# EasyEDA Pro project Class D amp.eprj, board PCB2
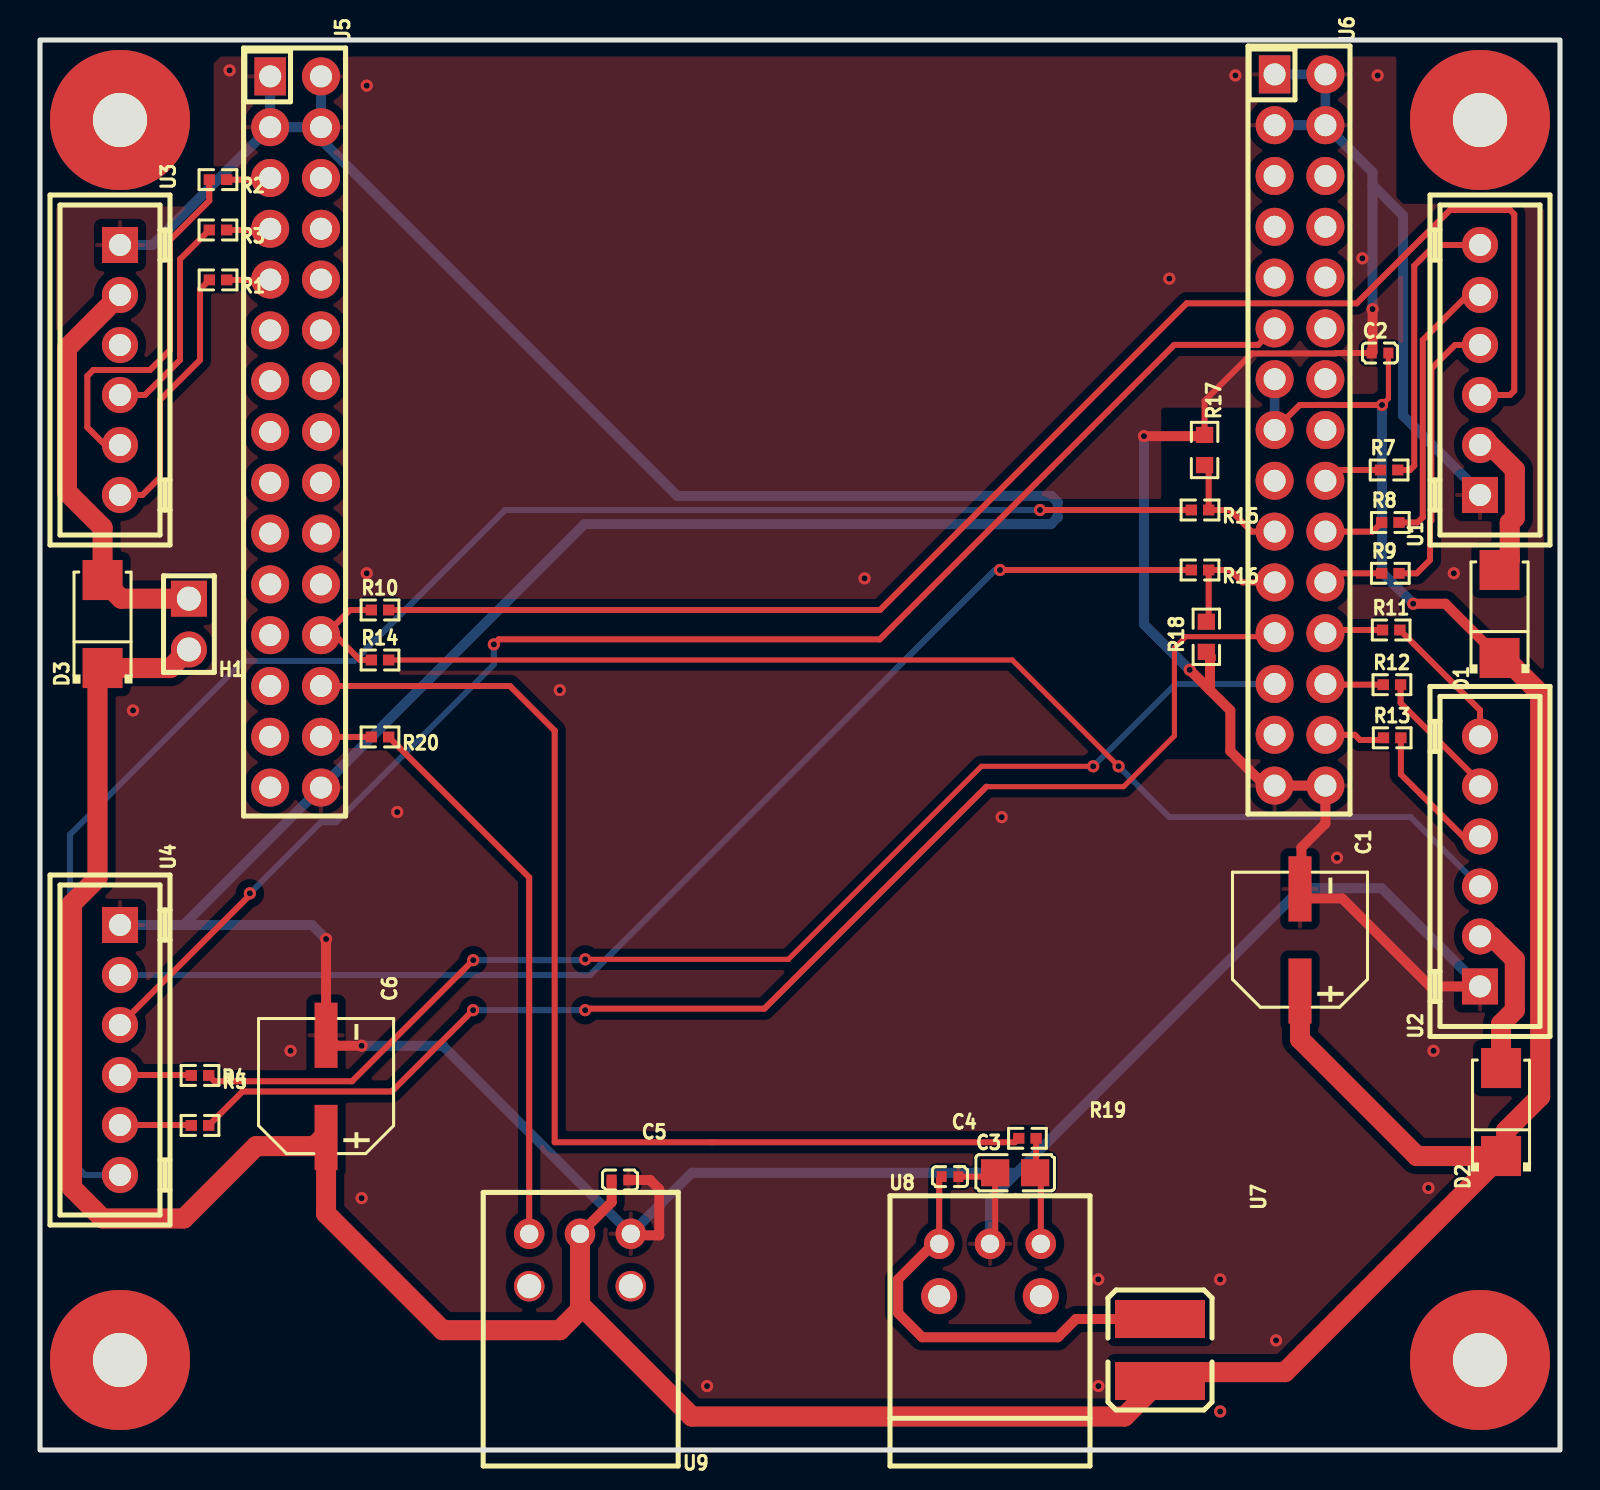
[diagram p8: board, top side]
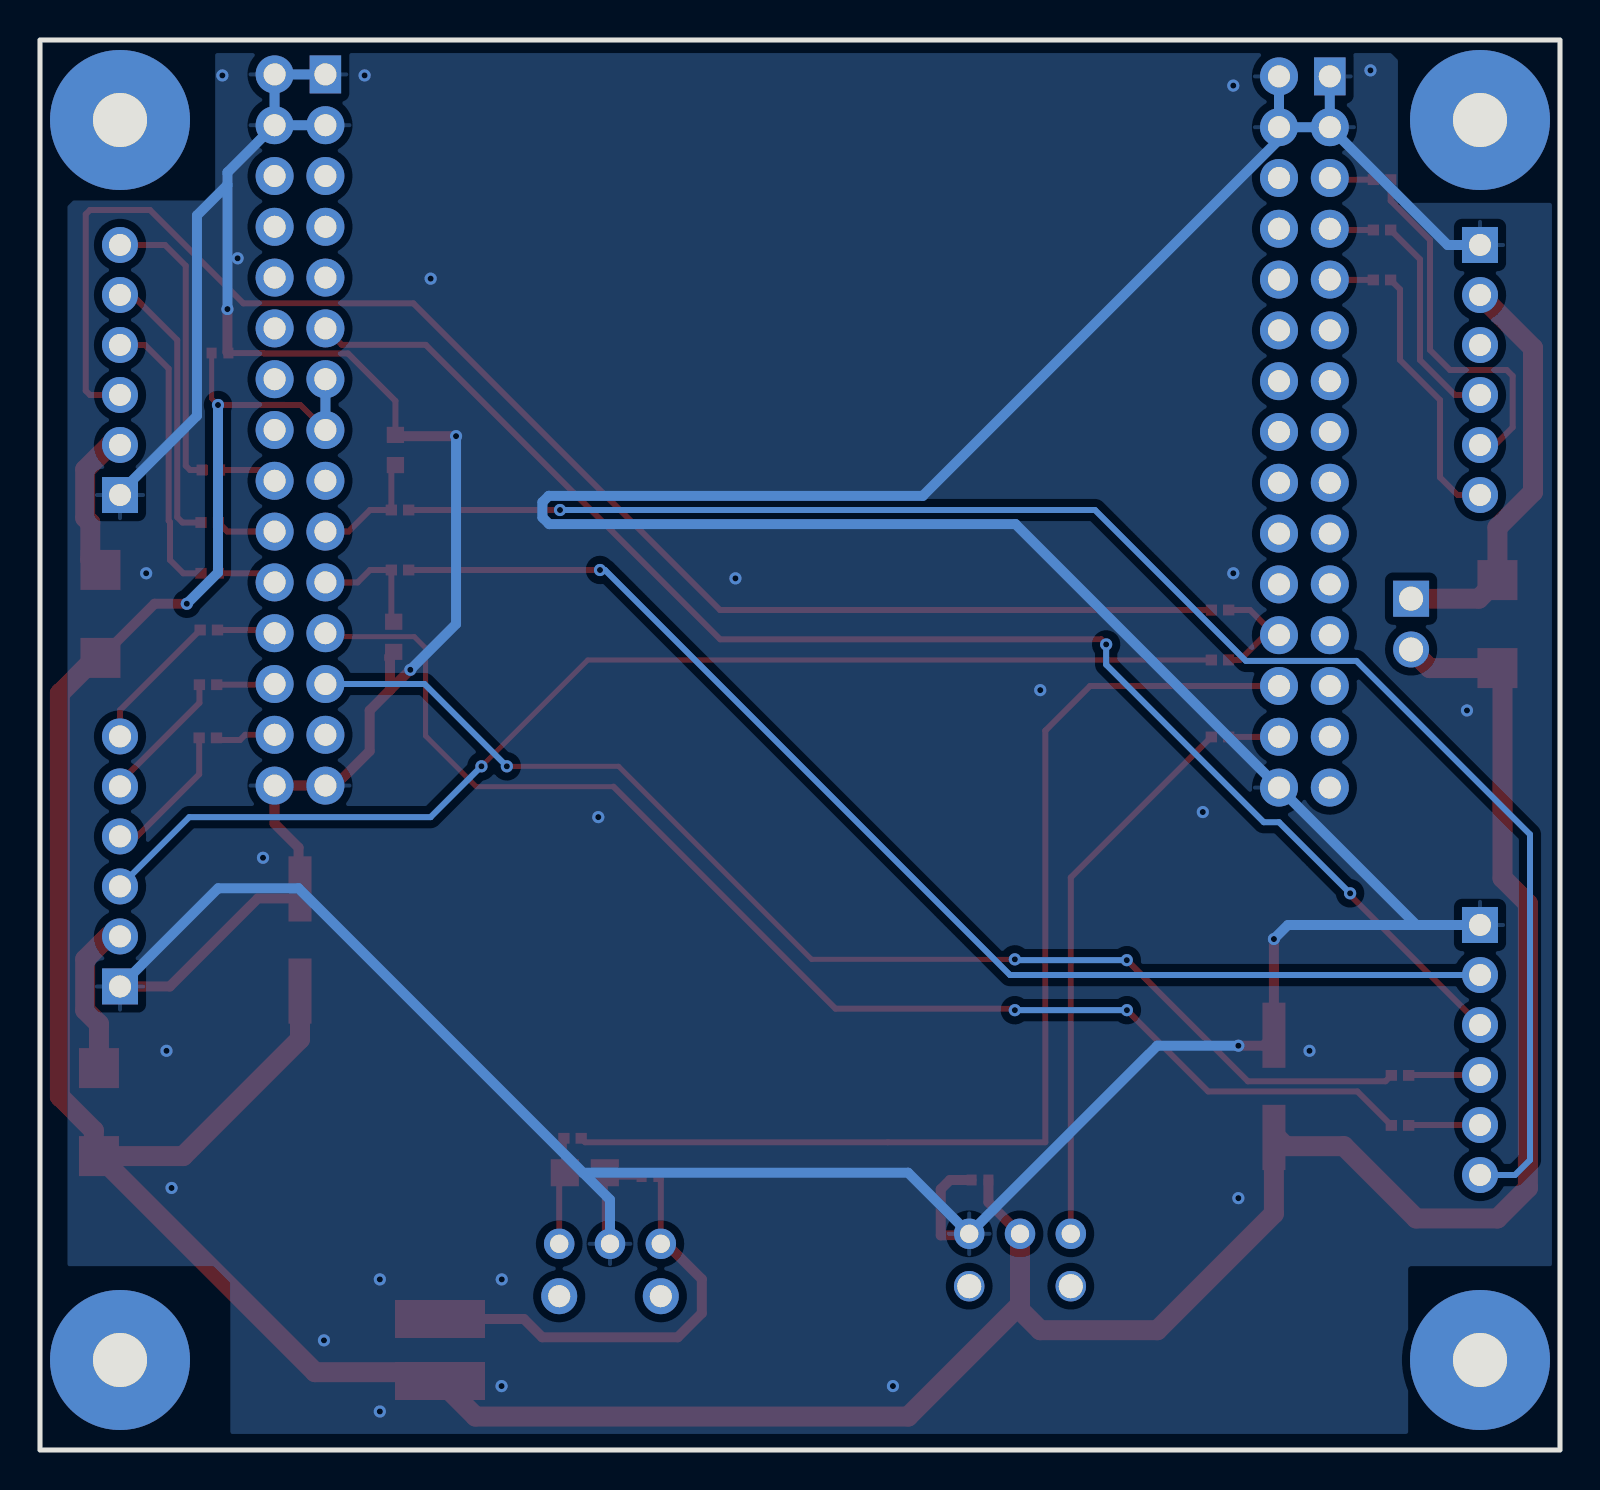
[diagram p9: board, bottom side, seen from below]

Outline 76 x 70.5 mm; copper layers: Top Layer, Bottom Layer. Coordinates in mm from the lower left corner of the outline.
Outline path: rectangle 0,70.5 76,0
Stack: Top Layer 0.035mm / Dielectric1 1.51mm FR4 er 4.5 / Bottom Layer 0.035mm

## Design rules (mm)
template: Custom Config
spacing copperThickness1oz (default): track to track 0.127, other pairs 0.152 to 0.3
spacing copperThickness2oz: track to track 0.203, other pairs 0.152 to 0.3
track width copperThickness1oz (default): min 0.127, default 0.254, max 2.54
track width copperThickness2oz: min 0.203, default 0.254, max 2.54
differential pair differentialPair (default): width min 0.127, default 0.254, max 2.54; gap min 0.152, default 0.152
via viaSize (default): diameter min 0.5, default 0.61, max 10; hole min 0.3, default 0.305, max 6.3

## Placement (name value [footprint] x y rotation side)
C1  47uF  [CAP-SMD_BD6.3-L6.6-W6.6-RD]  63 25.5 270 top
C2  100nF  [C0402]  67 54.85 0 top
C3  30pF  [C0805]  48.76 13.86 0 top
C4  100nF  [C0402]  45.5 13.67 180 top
C5  100nF  [C0402]  29 13.5 180 top
C6  47uF  [CAP-SMD_BD6.3-L6.6-W6.6-RD]  14.3 18.18 270 top
D1  SS34  [SMA_L4.3-W2.6-LS5.2-RD]  72.98 41.8 90 top
D2  SS34  [SMA_L4.3-W2.6-LS5.2-RD]  73.05 16.9 90 top
D3  SS34  [SMA_L4.3-W2.6-LS5.2-RD]  3.13 41.3 90 top
H1  PZ2.54V-1102P-H25  [HDR-TH_2P-P2.54-V-M-2]  7.45 41.3 180 top
NOREF  -  [Pad_e39]  4 4.5 0 top
NOREF#2  -  [Pad_e37]  4 66.5 0 top
NOREF#3  -  [Pad_e40]  72 4.5 0 top
NOREF#4  -  [Pad_e41]  72 66.5 0 top
R1  22Ω  [R0402]  8.9 58.5 180 top
R2  22Ω  [R0402]  8.9 63.52 180 top
R3  22Ω  [R0402]  8.9 61 180 top
R4  22Ω  [R0402]  8 16.23 180 top
R5  22Ω  [R0402]  8 18.73 180 top
R7  22Ω  [R0402]  67.46 49 0 top
R8  22Ω  [R0402]  67.52 46.37 0 top
R9  22Ω  [R0402]  67.52 43.83 0 top
R10  22Ω  [R0402]  17 42 0 top
R11  22Ω  [R0402]  67.56 41 0 top
R12  22Ω  [R0402]  67.6 38.27 0 top
R13  22Ω  [R0402]  67.61 35.61 0 top
R14  22Ω  [R0402]  17 39.5 0 top
R15  3.3kΩ  [R0402]  58 47 180 top
R16  3.3kΩ  [R0402]  58 44 180 top
R17  10kΩ  [R0603]  58.23 50 270 top
R18  10kΩ  [R0603]  58.32 40.66 90 top
R19  100Ω  [R0402]  49.37 15.58 180 top
R20  100Ω  [R0402]  17 35.65 180 top
U1  B6B-XH-A(LF)(SN)  [CONN-TH_6P-P2.50_B6B-XH-A-LF-SN]  72 54 90 top
U2  B6B-XH-A(LF)(SN)  [CONN-TH_6P-P2.50_B6B-XH-A-LF-SN]  72 29.43 90 top
U3  B6B-XH-A(LF)(SN)  [CONN-TH_6P-P2.50_B6B-XH-A-LF-SN]  4 54 270 top
U4  B6B-XH-A(LF)(SN)  [CONN-TH_6P-P2.50_B6B-XH-A-LF-SN]  4 20 270 top
U5  2.54-2*15P  [HDR-TH_30P-P2.54-V-F-R2-C15-S2.54]  12.78 50.9 270 top
U6  2.54-2*15P  [HDR-TH_30P-P2.54-V-F-R2-C15-S2.54]  63 51 270 top
U7  47uH  [IND-SMD_L4.5-W4.0]  56 5 270 top
U8  PLR237/T10BK  [OPTO-TH_PLR237-T10BK]  47.5 9 0 top
U9  PLT237/T10WH  [CONN-TH_PLT237-T10WH]  27 9.5 180 top

## Footprints (pads in the part's own frame, mm; a bottom-side part is the same pattern mirrored in y, then rotated)
C0402
  rect 0.5x0.54 smd: 1(-0.42,0) 2(0.42,0)
C0805
  rect 1.41x1.35 smd: 1(-1,0) 2(1,0)
CAP-SMD_BD6.3-L6.6-W6.6-RD
  rect 3.26x1.15 smd: 1(2.555,0) 2(-2.555,0)
CONN-TH_6P-P2.50_B6B-XH-A-LF-SN
  rect 1.8x1.8 hole 1.1: 1(-6.251,0.001)
  round 1.8 hole 1.1: 2(-3.749,-0.001) 3(-1.249,-0.001) 4(1.251,-0.001) 5(3.751,-0.001) 6(6.251,-0.001)
CONN-TH_PLT237-T10WH
  round 1.524 hole 0.914: 1(2.54,-1.31) 2(0,-1.31) 3(-2.54,-1.31)
  round 1.524 hole 1.2: 4(2.54,1.31) 5(-2.54,1.31)
HDR-TH_2P-P2.54-V-M-2
  rect 1.8x1.8 hole 1.2: 1(0,-1.27)
  round 1.8 hole 1.2: 2(0,1.27)
HDR-TH_30P-P2.54-V-F-R2-C15-S2.54
  rect 1.9x1.575 hole 1.1: 1(-17.78,-1.27)
  round 1.9 hole 1.1: 2(-17.78,1.27) 3(-15.24,-1.27) 4(-15.24,1.27) 5(-12.7,-1.27) 6(-12.7,1.27) 7(-10.16,-1.27) 8(-10.16,1.27) 9(-7.62,-1.27) 10(-7.62,1.27) 11(-5.08,-1.27) 12(-5.08,1.27) 13(-2.54,-1.27) 14(-2.54,1.27) 15(0,-1.27) 16(0,1.27) 17(2.54,-1.27) 18(2.54,1.27) 19(5.08,-1.27) 20(5.08,1.27) 21(7.62,-1.27) 22(7.62,1.27) 23(10.16,-1.27) 24(10.16,1.27) 25(12.7,-1.27) 26(12.7,1.27) 27(15.24,-1.27) 28(15.24,1.27) 29(17.78,-1.27) 30(17.78,1.27)
IND-SMD_L4.5-W4.0
  rect 1.9x4.5 smd: 1(-1.55,0) 2(1.55,0)
OPTO-TH_PLR237-T10BK
  round 1.524 hole 0.914: 1(-2.54,1.31) 2(0,1.31) 3(2.54,1.31)
  round 1.8 hole 1.1: 4(-2.54,-1.31) 5(2.54,-1.31)
Pad_e37
  round 7 hole 2.7: 1(0,0)
Pad_e39
  round 7 hole 2.7: 1(0,0)
Pad_e40
  round 7 hole 2.7: 1(0,0)
Pad_e41
  round 7 hole 2.7: 1(0,0)
R0402
  rect 0.566x0.54 smd: 1(-0.433,0) 2(0.433,0)
R0603
  rect 0.806x0.864 smd: 1(-0.753,0) 2(0.753,0)
SMA_L4.3-W2.6-LS5.2-RD
  rect 2x2 smd: 1(-2.2,0) 2(2.2,0)

## Nets
As in the schematic.

Pads without a net: NOREF 1; NOREF#2 1; NOREF#3 1; NOREF#4 1; U3 3; U5 6 8 10 11 12 13 14 15 16 17 18 19 20 21 22 23 25 27 29; U6 5 6 7 8 9 10 12 14 16 17 27; U8 4 5; U9 4 5

## Via types
v1: diameter 0.61, hole 0.305, Top Layer to Bottom Layer, 41 vias

## Routing (per net, layer and track width the routed paths; a pad name or vN(x,y) marks a point on that pad's centre or on a via; arc(x,y) is an arc through that point)
+5V: length 194.6
  Top Layer w0.254: C2.2 67.42,52.57 v1(67.1,52.25)
  Top Layer w0.3: U6.15 62.98,52.25 63.75,52.25 63.75,52.25 64.79,52.25 64.79,52.25 v1(67.1,52.25)
  Top Layer w0.5: v1(68.66,42.31) 70.27,42.31 D1.1 ; U9.2 28.58,12.39 C5.2
  Top Layer w1: 27,7.26 32.59,1.67 54.22,1.67 U7.2 ; 27,7.26 27,7 25.99,5.99 20.13,5.99 14.3,11.82 C6.1 ; 27,7.26 U9.2 ; H1.2 6.52,39.1 D3.1 2.87,38.84 2.87,28.6 1.6,27.33 1.6,13.1 3.13,11.58 7.19,11.58 10.81,15.19 13.72,15.19 14.23,15.7 ; C1.1 63,20.54 68.84,14.7 D2.1 ; D2.1 73.31,14.95 73.31,15.97 75.01,17.67 75.01,37.83 73.23,39.6 D1.1 ; D2.1 62.25,3.89 56.54,3.89
  Bottom Layer w0.5: U6.13 U6.15 ; v1(67.1,52.25) 67.1,43.87 v1(68.66,42.31)
GND: length 310.6
  Top Layer w0.3: R17.1 58.23,52.45 60.6,54.83 64.79,54.83 64.81,54.85 C2.1 ; U8.2 47.76,10.57 C3.1 47.57,13.67 C4.1
  Top Layer w0.5: R17.1 58.17,50.69 v1(55.2,50.69) ; v1(16.08,20.21) 14.83,20.21 14.3,20.74 v1(14.3,25.55) ; U9.3 29.62,10.73 30.96,10.73 30.96,13.04 30.5,13.5 C5.1 ; U2.1 69.51,23.18 65.1,27.58 63.47,27.58 C1.2 63.07,28.13 63.07,30.12 64.27,31.32 U6.30 U6.29 61.24,33.22 59.52,34.95 59.52,36.98 58.5,37.99 ; 58.5,37.99 58.5,39.52 58.53,39.55 58.53,39.69 58.32,39.91 ; 58.5,37.99 v1(57.48,39.01) ; C2.1 66.63,54.9 v1(66.63,57.04)
  Bottom Layer w0.5: U6.1 U6.2 U6.4 ; U5.4 U5.2 ; U5.4 14.05,65.51 31.86,47.71 50.56,47.71 50.88,47.39 50.88,46.63 50.54,46.29 27.22,46.29 U5.30 7.18,26.25 ; U5.4 U5.3 ; v1(16.08,20.21) 20.14,20.21 U9.3 32.59,13.86 48.85,13.86 ; U8.2 47.5,12.52 48.85,13.86 ; U5.3 5.62,60.25 U3.1 ; U5.3 U5.1 ; 48.85,13.86 63.07,28.09 67.09,28.09 U2.1 ; 66.63,63.25 66.63,63.88 U6.4 ; 66.63,63.25 68.15,61.73 68.15,51.71 72,47.86 U1.1 ; 66.63,63.25 v1(66.63,57.04) ; v1(57.48,39.01) 55.2,41.3 v1(55.2,50.69) ; 7.18,26.25 13.6,26.25 v1(14.3,25.55) ; 7.18,26.25 U4.1 ; U6.4 U6.3
  vias: v1(4.65,36.98) v1(9.48,68.98) v1(12.53,19.96) v1(16.08,12.59) v1(16.34,68.22) v1(16.34,43.84) v1(17.86,31.9) v1(25.99,37.99) v1(33.35,3.2) v1(41.23,43.58) v1(48.09,31.64) v1(52.91,8.53) v1(52.92,3.2) v1(56.47,58.57) v1(59.01,8.53) v1(59.01,1.93) v1(59.77,68.73) v1(61.8,5.48) v1(64.85,29.61) v1(66.12,59.58) v1(66.88,68.73) v1(69.42,13.1) v1(69.68,19.96) v1(70.69,43.84)
BCLK_IN0: length 2.2
  Top Layer w0.3: U5.5 11.43,63.52 R2.1
BCLK_OUT0: length 2.9
  Top Layer w0.3: R12.1 64.3,38.27 U6.26
BCLK_OUT1: length 3
  Top Layer w0.3: R8.1 66.63,45.92 U6.20
CLKO: length 5.9
  Top Layer w0.3: 14.24,40.74 15.5,42 R10.1 ; 14.24,40.74 14.76,40.74 16,39.5 R14.1 ; 14.24,40.74 U5.24
LRCK_OUT0: length 3.1
  Top Layer w0.3: U6.28 65.74,35.76 66,35.5 67.07,35.5 R13.1
LRCK_OUT1: length 3
  Top Layer w0.3: U6.22 64.72,43.83 R9.1
LRCLK_IN0: length 2.2
  Top Layer w0.3: R3.1 11.45,61 U5.7
RST: length 72.8
  Top Layer w0.3: U4.3 10.49,27.74 v1(10.49,27.83) ; U6.11 60.91,55.25 56.71,55.25 41.99,40.53 22.94,40.53 22.69,40.28
  Bottom Layer w0.3: v1(10.49,27.83) 14.05,31.39 14.81,31.39 22.69,39.27 v1(22.69,40.28)
SDATA_IN0: length 2.2
  Top Layer w0.3: R1.1 11.49,58.5 U5.9
SDATA_OUT0: length 2.9
  Top Layer w0.3: R11.1 64.43,41 U6.24
SDATA_OUT1: length 3
  Top Layer w0.3: R7.1 64.81,49 U6.18
SPDIF_IN: length 56.5
  Top Layer w0.3: R19.2 48.74,15.39 25.73,15.39 25.73,35.96 23.5,38.2 U5.26
SPDIF_OUT: length 2.5
  Top Layer w0.3: U5.28 14.06,35.65 R20.2
USBI_MISO: length 61.6
  Top Layer w0.254: v1(52.66,34.18) 47.07,34.18 37.42,24.53 v1(27.26,24.53)
  Top Layer w0.3: v1(21.66,24.49) 15.6,18.44 8.73,18.44 R5.1
  Bottom Layer w0.3: v1(52.66,34.18) 56.77,38.3 U6.25 ; v1(21.66,24.49) 27.22,24.49 v1(27.26,24.53)
USBI_MOSI: length 6.2
  Top Layer w0.3: R18.2 58.43,41.53 R16.1 59.5,44 60.12,43.38 U6.21
USBI_SCLK: length 66.1
  Top Layer w0.254: 47.32,33.17 54.18,33.17 56.72,35.71 56.72,40.1 57.28,40.67 61.22,40.67 61.48,40.92 61.65,40.92 U6.23
  Top Layer w0.3: 47.32,33.17 36.22,22.07 27.26,22.07 ; v1(21.66,21.99) 17.59,17.93 10.13,17.93 R4.1
  Bottom Layer w0.3: v1(21.66,21.99) v1(27.26,21.99)
USBI_SS: length 6.1
  Top Layer w0.3: R17.2 58.43,49.04 R15.1 59.5,47 60.58,45.92 U6.19
$1N2334: length 13.3
  Top Layer w0.3: R1.2 8,58.03 8,54.5 6,52.5 6,48.63 5.12,47.75 U3.6
$1N2378: length 18.6
  Top Layer w0.3: U3.5 3.25,50.25 2.37,51.13 2.37,53.7 2.67,54 5.5,54 6.5,55 6.5,60.5 8.47,62.47 R2.2
$1N2459: length 10.8
  Top Layer w0.3: R3.2 7,59.53 7,54.5 5.25,52.75 U3.4
$1N2540: length 3.6
  Top Layer w0.3: U4.5 7.55,16.25 R4.2
$1N2584: length 3.5
  Top Layer w0.3: U4.4 7.5,18.75
$1N2632: length 14.6
  Top Layer w0.3: R7.2 68.5,49 68.71,49.21 68.71,59.21 69.75,60.25 U1.6
$1N2672: length 14
  Top Layer w0.3: R8.2 68.87,46.37 69.14,46.64 69.14,55.5 71.39,57.75 U1.5
$1N2720: length 14.3
  Top Layer w0.3: U1.4 70.75,55.25 69.57,54.07 69.57,46.46 69.5,46.4 69.5,44.5 68.83,43.83 R9.2
$1N2760: length 75.3
  Top Layer w0.3: U1.3 73.5,52.75 73.71,52.96 73.71,61.79 73.5,62 70.5,62 65.83,57.33 57.33,57.33 42,42 R10.2
$1N2808: length 7
  Top Layer w0.3: U2.6 72,36.99 R11.2
$1N2926: length 59.3
  Top Layer w0.254: v1(53.93,34.18) 48.61,39.5 R14.2
  Bottom Layer w0.3: v1(53.93,34.18) 56.47,31.64 68.54,31.64 U2.3
$1N2937: length 7.1
  Top Layer w0.3: R13.2 68.04,33.79 71.2,30.63 71.95,30.63 U2.4
$1N2944: length 6.7
  Top Layer w0.3: R12.2 68.03,37.35 72,33.38 U2.5
$1N3358: length 21.9
  Top Layer w0.3: U8.1 44.96,13.55 C4.2
  Top Layer w0.5: U8.1 44.68,10.31 42.91,8.54 42.91,6.84 44.11,5.64 50.89,5.64 51.8,6.55 U7.1
$1N3377: length 5.4
  Top Layer w0.3: R19.1 49.81,13.91 C3.2 50.04,13.58 U8.3
$1N3409: length 27.8
  Top Layer w0.3: R20.1 24.46,28.62 U9.1
$1N6189: length 81.9
  Top Layer w0.3: R15.2 v1(50,47)
  Bottom Layer w0.3: v1(50,47) 23.25,47 15.7,39.45 10.17,39.45 1.5,30.78 1.5,14.5 2.25,13.75 U4.6
$1N6196: length 62
  Top Layer w0.3: R16.2 v1(48,44)
  Bottom Layer w0.3: v1(48,44) 47.75,44 27.5,23.75 U4.2
$1N8376: length 20.8
  Top Layer w1: H1.1 4.06,42.57 D3.2 3.13,46.12 1.35,47.9 1.35,55.1 U3.2
$1N9564: length 7.6
  Top Layer w1: U1.2 72.51,50.25 73.74,49.02 73.74,46.61 73.49,46.36 73.49,44.51 D1.2
$1N9604: length 7.9
  Top Layer w1: D2.2 73.05,21.3 73.74,21.99 73.74,24.53 72.59,25.68 U2.2

## Copper pours and planes (outline as drawn; the poured copper is in the pictures)
GND on Top Layer: 0.65,9.12 0.65,62.33 8.4,62.33 8.53,62.2 8.53,69.38 8.97,69.82 67.71,69.82 67.96,70.08 67.96,62.71 68.22,62.46 74.97,62.46 75.35,62.08 75.35,8.86 67.96,8.86 67.2,8.1 67.2,0.48 8.02,0.48 8.02,8.86 0.91,8.86
GND on Bottom Layer: 0.08,9.29 0.08,62.5 7.83,62.5 7.95,62.38 7.95,69.56 8.39,70 67.13,70 67.39,70.25 67.39,62.89 67.64,62.63 74.4,62.63 74.78,62.25 74.78,9.04 67.39,9.04 66.63,8.28 66.63,0.66 7.45,0.66 7.45,9.04 0.33,9.04

Small or netless copper shapes (teardrops, artwork), in the pictures only: 1 on Bottom Layer
